# Altium schematic sheet 003_Debugging.SchDoc
size A4; Organization: OLTEST; Revision: 01; SheetNumber: 3; SheetTotal: 12; Название листа: Название листа; Разработчик: Бондарчук С.; Прибор: R100; АМАК.000000.000 Э3: R100.220.040.000 Э3; Дата: 03.01.2018; Формат: A4
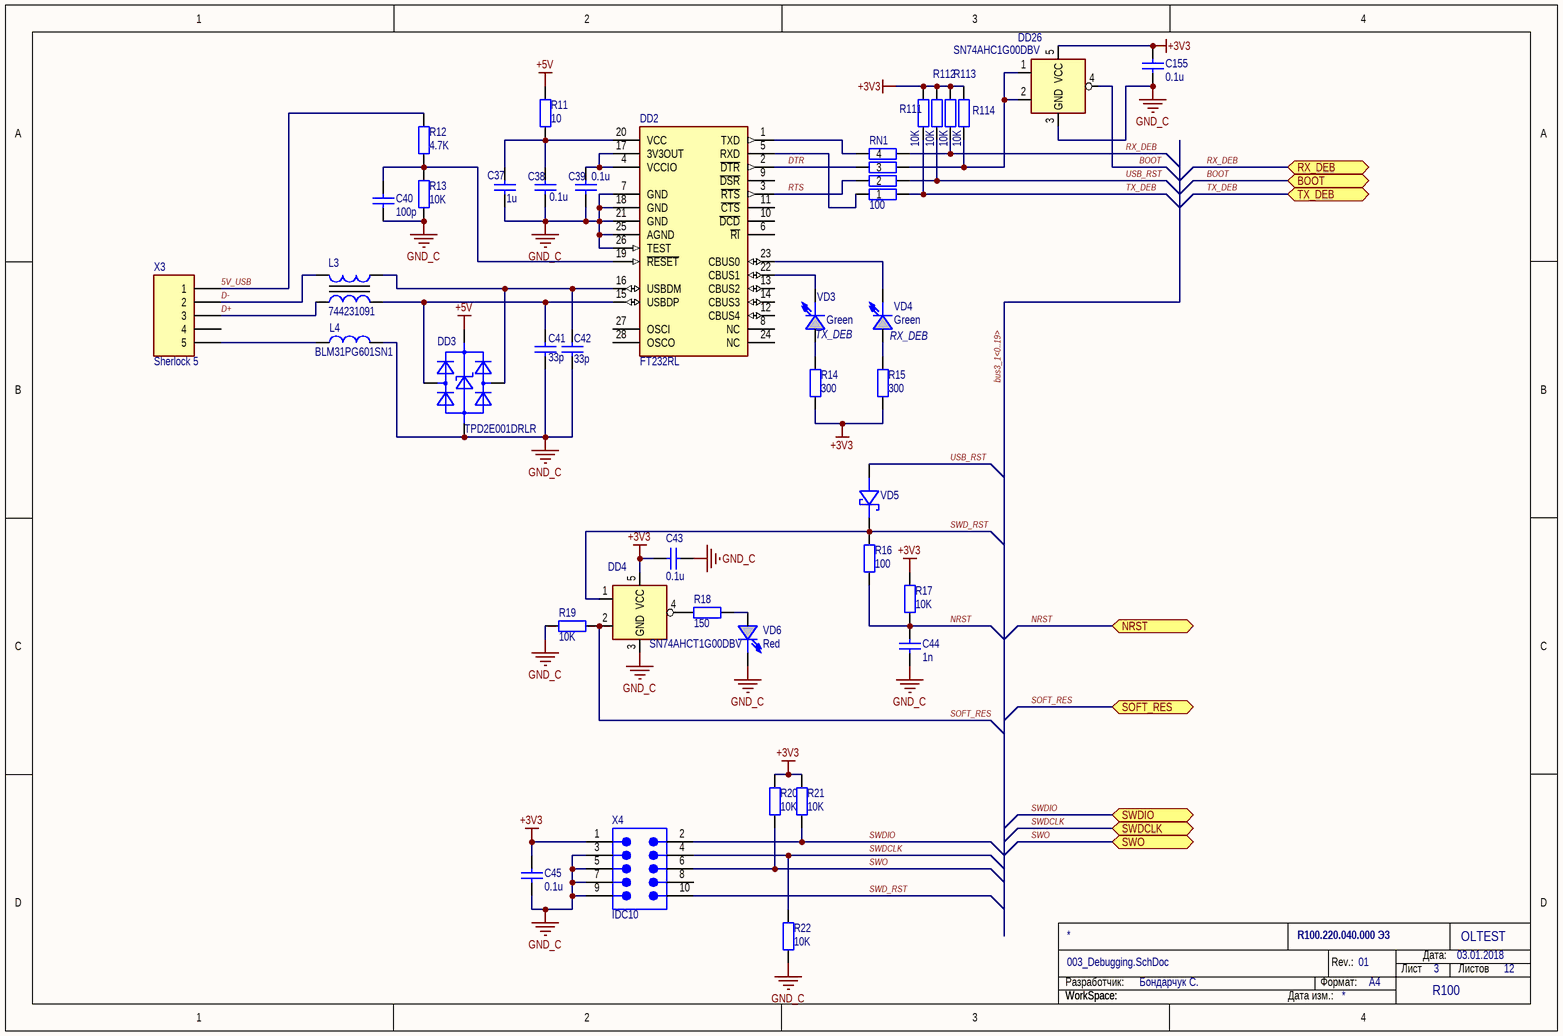
[diagram p0: 003_Debugging.SchDoc]

## Parts
C37  1u  [SMD_C_0603]
C38  0.1u  [SMD_C_0603]
C39  0.1u  [SMD_C_0603]
C40  100p  [SMD_C_0603]
C41  33p  [SMD_C_0603]
C42  33p  [SMD_C_0603]
C43  0.1u  [SMD_C_0603]
C44  1n  [SMD_C_0603]
C45  0.1u  [SMD_C_0603]
C155  0.1u  [SMD_C_0603]
DD2  FT232RL  [SSOP-28_M]
DD3  TPD2E001DRLR  [DRL5_M]
DD4  SN74AHCT1G00DBV  [SOT-23(DBV)]
DD26  SN74AHC1G00DBV  [SOT-23(DBV)]
L3  744231091  [WE-CNSW-0805]
L4  BLM31PG601SN1  [SMD_L_1206]
R11  10  [SMD_R_0805]
R12  4.7K  [SMD_R_0805]
R13  10K  [SMD_R_0805]
R14  300  [SMD_R_0805]
R15  300  [SMD_R_0805]
R16  100  [SMD_R_0603]
R17  10K  [SMD_R_0603]
R18  150  [SMD_R_0805]
R19  10K  [SMD_R_0603]
R20  10K  [SMD_R_0603]
R21  10K  [SMD_R_0603]
R22  10K  [SMD_R_0603]
R111  10K  [SMD_R_0603]
R112  10K  [SMD_R_0603]
R113  10K  [SMD_R_0603]
R114  10K  [SMD_R_0603]
RN1  100  [CRA06S]
VD3  value Green  [SMD_LED_LL_Green]  (hidden comment: LL-S172GC-2A)
VD4  value Green  [SMD_LED_LL_Green]  (hidden comment: LL-S172GC-2A)
VD5  MBR0540T1G  [SOD-123]  (value not drawn)
VD6  value Red  [SMD_LED_LL_Red]  (hidden comment: LL-S172SC-2S)
X3  Sherlock 5  [35362-0550]
X4  IDC10  [918510x324]

## Ports
BOOT, NRST, RX_DEB, SOFT_RES, SWDCLK, SWDIO, SWO, TX_DEB

## Nets
+3V3: C43.2 C45.2 C155.1 DD4.5(VCC) DD26.5(VCC) R14.1 R15.1 R17.2 R20.2 R21.2 R111.2 R112.2 R113.2 R114.2 X4.1
+5V: DD3.1(VCC) R11.2
GND_C: C37.1 C38.1 C39.1 C40.1 C41.2 C42.2 C43.1 C44.1 C45.1 C155.2 DD2.7(GND) DD2.18(GND) DD2.21(GND) DD2.25(AGND) DD2.26(TEST) DD3.4(GND) DD4.3(GND) DD26.3(GND) L4.2 R13.1 R19.2 R22.1 VD6.2(CATHODE) X4.3 X4.5 X4.7 X4.9
5V_USB: R12.2 X3.1
BOOT: DD26.4 ; port BOOT
D+: L3.1 X3.3
D-: L3.4 X3.2
DTR: DD2.2(~{DTR}) RN1.3
NRST: C44.2 R16.1 R17.1 ; port NRST
RTS: DD2.3(~{RTS}) RN1.2
RX_DEB: R113.1 RN1.5 ; port RX_DEB
SOFT_RES: DD4.2 R19.1 ; port SOFT_RES
SWD_RST: DD4.1 R16.2 VD5.1(Cathode) X4.10
SWDCLK: R22.2 X4.4 ; port SWDCLK
SWDIO: R21.1 X4.2 ; port SWDIO
SWO: R20.1 X4.6 ; port SWO
TX_DEB: R111.1 RN1.8 ; port TX_DEB
USB_RST: R112.1 RN1.7 VD5.2(Anode)
NetC37_2: C37.2 C38.2 DD2.20(VCC) R11.1
NetC39_2: C39.2 DD2.4(VCCIO) DD2.17(3V3OUT)
NetC40_2: C40.2 DD2.19(~{RESET}) R12.1 R13.2
NetC41_1: C41.1 DD2.15(USBDP) DD3.3(IO1) L3.2
NetC42_1: C42.1 DD2.16(USBDM) DD3.5(IO2) L3.3
NetDD2_1: DD2.1(TXD) RN1.4
NetDD2_5: DD2.5(RXD) RN1.1
NetDD2_22: DD2.22(CBUS1) VD3.2(CATHODE)
NetDD2_23: DD2.23(CBUS0) VD4.2(CATHODE)
NetDD4_4: DD4.4 R18.1
NetDD26_1: DD26.1 DD26.2 R114.1 RN1.6
NetL4_1: L4.1 X3.5
NetR14_2: R14.2 VD3.1(ANODE)
NetR15_2: R15.2 VD4.1(ANODE)
NetR18_2: R18.2 VD6.1(ANODE)

Not connected (* = marked no-connect by the designer): DD2 6(~{RI}) 8(NC) 9(~{DSR}) 10(~{DCD}) 11(~{CTS}) 12(CBUS4) 13(CBUS2) 14(CBUS3) 24(NC) 27(OSCI) 28(OSCO); X3 4; X4 8

## Buses and harness runs
bus bus3_1<0..19>

## Notes on the sheet
- (near VD3) TX_DEB
- (near VD4) RX_DEB
- Разработчик:
- Формат:
- Rev.:
- Лист
- Дата:
- Листов
- WorkSpace:
- Дата изм.:
- (in symbol SN74AHC1G00DBV) &
- (in symbol SN74AHCT1G00DBV) &

## Library data of the parts
C37 = C0603 1uF 25V 10%: SMD C 0603 MURATA 25V 10% X7R; PartNumber: GRM188R71E105KA12; Manufacturer: MURATA; Value: 1u
C38 C39 C43 C45 C155 = C0603 0.1u 50V 10%: SMD C 0603 MURATA 50V 10% X7R; PartNumber: GRM188R71H104K; Manufacturer: MURATA; Value: 0.1u
C40 = C0603 100p 100V 5%: SMD C 0603 MURATA 100V 5% NP0; PartNumber: GRM1885C2A101JA01; Manufacturer: MURATA; Value: 100p
C41 C42 = C0603 33p 50V 5%: SMD C 0603 MURATA 50V 5% NP0; PartNumber: GRM1885C1H330JA01; Manufacturer: MURATA; Value: 33p
C44 = C0603 1n 50V 5%: SMD C 0603 MURATA 50V 5% NP0; PartNumber: GRM1885C1H102JA01; Manufacturer: MURATA; Value: 1n
DD2 = FT232RL: USB UART Asynchronous Serial Data Transfer Chip, 28-pin SSOP; Manufacturer: FTDI; PartNumber: FT232RL
DD3 = TPD2E001DRLR: Low-Capacitance + / - 15 kV ESD-Protection Array for High-Speed Data Interfaces, 2 Channels, -40 to +85 degC, 5-pin SOT (DRL), Green (RoHS & no Sb/Br); Manufacturer: Texas Instruments; PartNumber: TPD2E001DRLR
DD4 = SN74AHCT1G00DBV: 2-in NAND; Manufacturer: Texas Instruments; PartNumber: SN74AHCT1G00DBV
DD26 = SN74AHC1G00DBV: 2-in NAND; Manufacturer: Texas Instruments; PartNumber: SN74AHC1G00DBV
L3 = 744231091: SMD Common Mode Noise Suppressor WE-CNSW, Z = 90 Ohm; Manufacturer: Wurth Elektronik; Impedance: 90 Ohm; DatasheetVersion: ver 4, Nov-2010; PackageReference: WE-CNSW-0805; PackageDescription: SMD Inductor, 4-Leads, Body 1.4 x 2.2 mm; PartNumber: 744231091
L4 = BLM31PG601SN1: 600R 1.5A (100MHz); Manufacturer: TDK; Value: 600R 1.5A (100MHz); PartNumber: BLM31PG601SN1
R11 = R0805 10 1%: SMD R 0805 VISHAY 0.125W 150V 1% 100ppm; PartNumber: CRCW080510R0FK; Manufacturer: VISHAY; Value: 10
R12 = R0805 4.7K 1%: SMD R 0805 VISHAY 0.125W 150V 1% 100ppm; PartNumber: CRCW08054K70FK; Manufacturer: VISHAY; Value: 4.7K
R13 = R0805 10K 1%: SMD R 0805 VISHAY 0.125W 150V 1% 100ppm; PartNumber: CRCW080510K0FK; Manufacturer: VISHAY; Value: 10K
R14 R15 = R0805 300 1%: SMD R 0805 VISHAY 0.125W 150V 1% 100ppm; PartNumber: CRCW0805300RFK; Manufacturer: VISHAY; Value: 300
R16 = R0603 100 1%: SMD R 0603 VISHAY 0.1W 75V 1% 100ppm; PartNumber: CRCW0603100RFK; Manufacturer: VISHAY; Value: 100
R17 R19-R22 R111-R114 = R0603 10К 1%: SMD R 0603 VISHAY 0.1W 75V 1% 100ppm; PartNumber: CRCW060310K0FK; Manufacturer: VISHAY; Value: 10K
R18 = R0805 150 1%: SMD 0805 VISHAY 0.125W 150V 1% 100ppm; PartNumber: CRCW0805150RFK; Manufacturer: VISHAY; Value: 150
RN1 = CRA06S 4x100 1%: SMD RESISTOR ARRAY VISHAY 0.063W 50V 1% 100ppm; PartNumber: CRA06S083100RF; Manufacturer: VISHAY; Value: 100
VD3 VD4 = LL-S172GC-2A: LED Green SMD; Manufacturer: Lucky Light; PartNumber: LL-S172GC-2A
VD5 = MBR0540T1G: 0.5A/40V Schottky Diode (SOD-123); Manufacturer: ON Semiconductor; PartNumber: MBR0540T1G
VD6 = LL-S172SC-2S: LED Red SMD; Manufacturer: Lucky Light; PartNumber: LL-S172SC-2S
X3 = 35362-0550: Sherlock 5 Top, 2A 125V 2mm; Manufacturer: MOLEX; PartNumber: 35362-0550
X4 = Harting IDC10 904: Flat Cable Connector (IDC), Standard Male Header, Straight Solder Pin, 10 Contacts, Long Levers, Performance Level 2; PartNumber: 09 18 510 6904; PCB_Layout: Complies with manufacturer's recommendation.; DrillSize: Corresponds to nominal value.; Published: 15-Nov-2004; DatasheetDocument: Sep-2003; PackageDocument: Jun-2000; PackageReference: 918510x904; Publisher: Altium Limited; ComponentLink1Description: Manufacturer Link; ComponentLink1URL: http://www.harting.com/; ComponentLink2Description: Selection Guide; ComponentLink2URL: http://www.harting.com/imperia/md/content/steckverbinderundsystemkomponenten/folder/interface_engl_chapter_09.pdf